# Altium schematic sheet WIFI.SchDoc
size A4; SheetNumber: 5; SheetTotal: 7
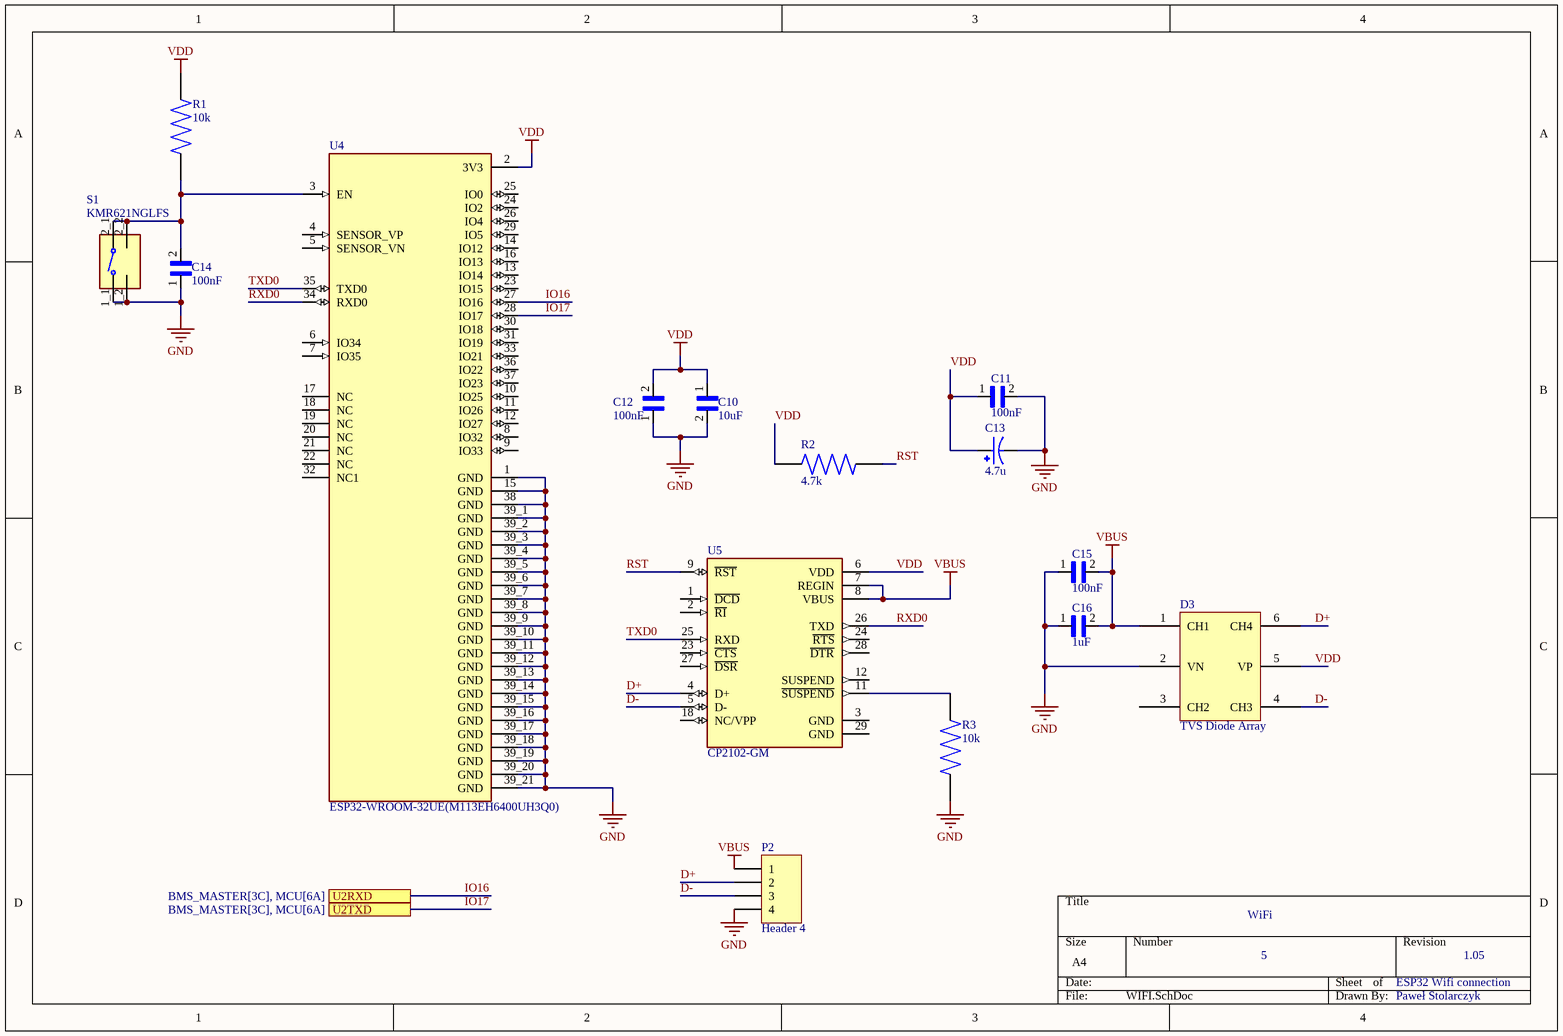
[diagram p0: WIFI.SchDoc]

## Parts
C10  10uF  [CAPC1608X90N]
C11  100nF  [CAPC1608X90N]
C12  100nF  [CAPC1608X90N]
C13  4.7u  [CAP_EEE1CA100SR]
C14  100nF  [CAPC1608X90N]
C15  100nF  [CAPC1608X90N]
C16  1uF  [CAPC1608X90N]
D3  TVS Diode Array  [SOT23-6-V2]
P2  Header 4  [HDR1X4]
R1  10k  [0402]
R2  4.7k  [0402]
R3  10k  [0402]
S1  KMR621NGLFS  [SW_KMR621NGLFS]
U4  ESP32-WROOM-32UE(M113EH6400UH3Q0)  [MODULE_ESP32-WROOM-32UE(M113EH6400UH3Q0)]
U5  CP2102-GM  [QFN50P500X500X100-29N]

## Ports
U2RXD (see BMS_MASTER[3C], MCU[6A]), U2TXD (see BMS_MASTER[3C], MCU[6A])

## Nets
GND: C10.2 C11.2 C12.1 C13.2 C14.1 C15.1 C16.1 D3.2(VN) P2.4 R3.2 S1.1_1 S1.1_2 U4.1(GND) U4.15(GND) U4.38(GND) U4.39_1(GND) U4.39_2(GND) U4.39_3(GND) U4.39_4(GND) U4.39_5(GND) U4.39_6(GND) U4.39_7(GND) U4.39_8(GND) U4.39_9(GND) U4.39_10(GND) U4.39_11(GND) U4.39_12(GND) U4.39_13(GND) U4.39_14(GND) U4.39_15(GND) U4.39_16(GND) U4.39_17(GND) U4.39_18(GND) U4.39_19(GND) U4.39_20(GND) U4.39_21(GND)
VBUS: C15.2 C16.2 D3.1(CH1) P2.1 U5.7(REGIN) U5.8(VBUS)
VDD: C10.1 C11.1 C12.2 C13.1 D3.5(VP) R1.1 R2.2 U4.2(3V3) U5.6(VDD)
D+: D3.6(CH4) P2.2 U5.4(D+)
D-: D3.4(CH3) P2.3 U5.5(D-)
IO16: U4.27(IO16) ; port U2RXD
IO17: U4.28(IO17) ; port U2TXD
RST: R2.1 U5.9(~{RST})
RXD0: U4.34(RXD0) U5.26(TXD)
TXD0: U4.35(TXD0) U5.25(RXD)
NetC14_2: C14.2 R1.2 S1.2_1 S1.2_2 U4.3(EN)
NetR3_1: R3.1 U5.11(~{SUSPEND})

Not connected (* = marked no-connect by the designer): D3 3(CH2); U4 4(SENSOR_VP) 5(SENSOR_VN) 6(IO34) 7(IO35) 8(IO32) 9(IO33) 10(IO25) 11(IO26) 12(IO27) 13(IO14) 14(IO12) 16(IO13) 17(NC) 18(NC) 19(NC) 20(NC) 21(NC) 22(NC) 23(IO15) 24(IO2) 25(IO0) 26(IO4) 29(IO5) 30(IO18) 31(IO19) 32(NC1) 33(IO21) 36(IO22) 37(IO23); U5 1(~{DCD}) 2(~{RI}) 3(GND) 12(SUSPEND) 18(NC/VPP) 23(~{CTS}) 24(~{RTS}) 27(~{DSR}) 28(~{DTR}) 29(GND)

## Notes on the sheet
- WiFi
- 5
- ESP32 Wifi connection
- 1.05
- Paweł Stolarczyk

## Library data of the parts
C10-C12 C14-C16 = C0603C104J4RAC: 0.1ÂµF Â±5% 16V Ceramic Capacitor X7R 0603 (1608 Metric); MF: KEMET; MP: C0603C104J4RAC; SnapEDA_Link: https://www.snapeda.com/parts/C0603C104J4RAC/KEMET/view-part/1763758/?ref=snap; Availability: Warning; Package: 0603 KEMET; Check_prices: https://www.snapeda.com/parts/C0603C104J4RAC/KEMET/view-part/1763758/?ref=eda; Value: *; Price: None
C13 = EEE1CA100SR: 10ÂµF 16V Aluminum Electrolytic Capacitors Radial, Can - SMD 2000 Hrs @ 85Â°C; MF: Panasonic; Digi-Key_Part_Number: PCE3878CT-ND; Check_prices: https://www.snapeda.com/parts/EEE1CA100SR/Panasonic/view-part/?ref=eda; Value: *; MP: EEE1CA100SR; Package: RADIAL-2 Panasonic; SnapEDA_Link: https://www.snapeda.com/parts/EEE1CA100SR/Panasonic/view-part/?ref=snap
D3 = AOZ8105: Ultra-Low Capacitance TVS Diode Array
P2 = Header 4: Header, 4-Pin; LatestRevisionDate: 17-Jul-2002; LatestRevisionNote: Re-released for DXP Platform.; Publisher: Altium Limited
R1-R3 = RK73H1JTTD1102F: Rezystor, SMD 11 kOhm, Â± 1 %, 0603 ¦ KOA RK73H1JTTD1102F @ Metal film resistor SMD (Rezystor, SMD 11 kOhm, Â± 1 %, 0603 Rezystory SMD /; Package: None; Price: None; Value: *; MP: RK73H1JTTD1102F; Availability: Unavailable
S1 = KMR621NGLFS: Tactile Switch SPST-NO Top Actuated Surface Mount; MF: C&K; Package: None; Value: *; Price: None; MP: KMR621NG LFS; SnapEDA_Link: https://www.snapeda.com/parts/KMR621NG%20LFS/C%26K/view-part/2720743/?ref=snap; Availability: Unavailable
U4 = ESP32-WROOM-32UE(M113EH6400UH3Q0): Bluetooth, WiFi 802.11b/g/n, Bluetooth v4.2 +EDR, Class 1, 2 and 3 Transceiver Module 2.4GHz ~ 2.5GHz Antenna Not Included, U.FL Surface Mount; MF: Espressif Systems; Price: None; Check_prices: https://www.snapeda.com/parts/ESP32-WROOM-32UE(M113EH6400UH3Q0)/Espressif+Systems/view-part/?ref=eda; Value: *; Package: None; SnapEDA_Link: https://www.snapeda.com/parts/ESP32-WROOM-32UE(M113EH6400UH3Q0)/Espressif+Systems/view-part/?ref=snap; MP: ESP32-WROOM-32UE(M113EH6400UH3Q0); Availability: Not in stock
U5 = CP2102-GM: USB Bridge, USB to UART USB 2.0 UART Interface 28-QFN (5x5); MF: Silicon Labs; Price: None; Availability: In Stock; MP: CP2102-GM; Package: QFN-28 Silicon Labs; SnapEDA_Link: https://www.snapeda.com/parts/CP2102-GM/Silicon+Labs/view-part/?ref=snap; Check_prices: https://www.snapeda.com/parts/CP2102-GM/Silicon+Labs/view-part/?ref=eda; Value: *; Purchase-URL: https://pricing.snapeda.com/search/part/CP2102-GM/?ref=eda